# EAGLE schematic ZXUno_Companion_2 (EAGLE 7.6.0)

## Sheet 1 of 2
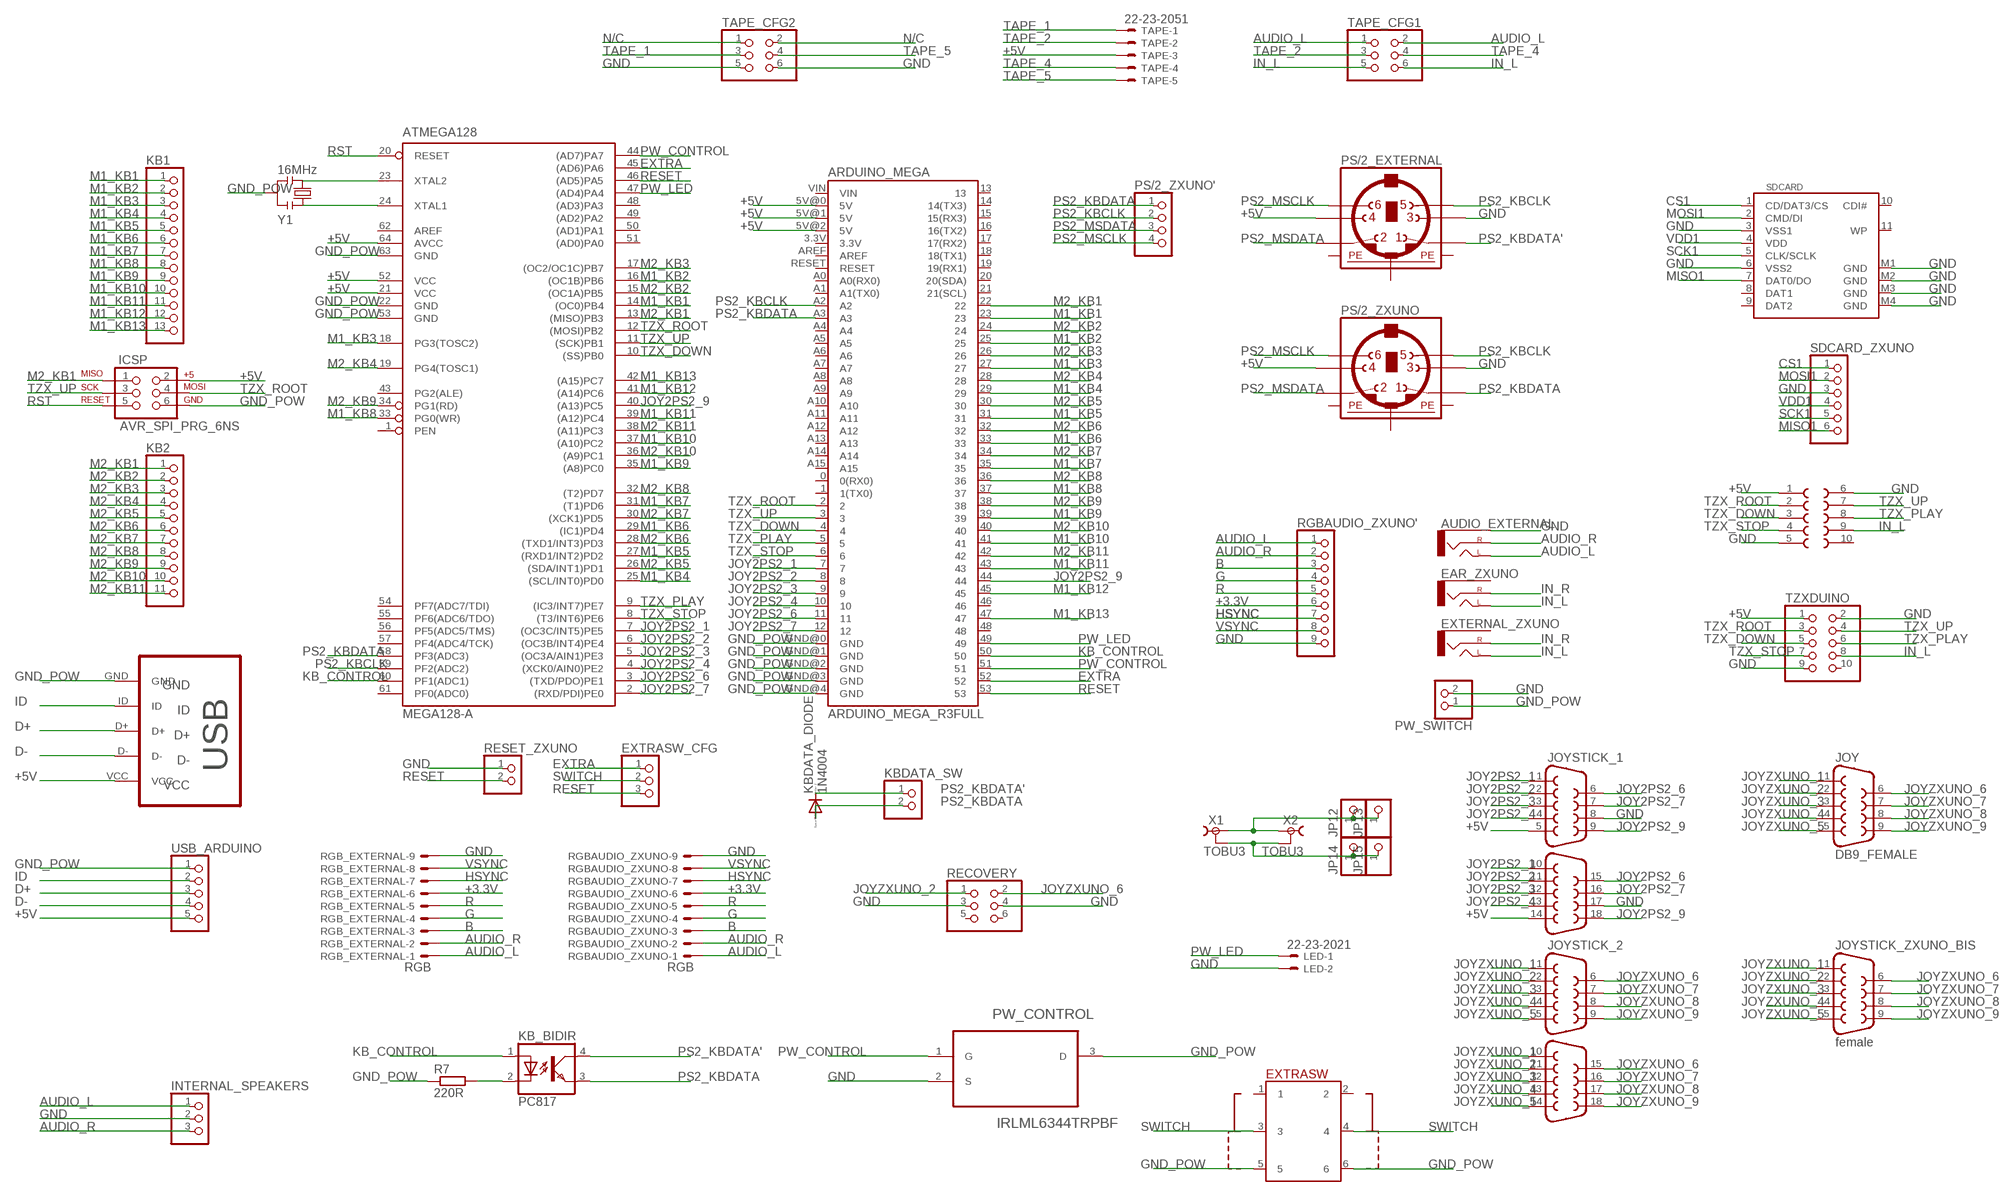
[diagram p0: schematic, sheet 1]

### Parts
ARDUINO_MEGA  ARDUINO_MEGA_R3FULL  [ARDUINO_MEGA]
ATMEGA128  MEGA128-A  [TQFP64]
AUDIO_EXTERNAL  AUDIO-JACKPTH  [AUDIO-JACK]
EAR_ZXUNO  AUDIO-JACKPTH  [AUDIO-JACK]
EXTERNAL_ZXUNO  AUDIO-JACKPTH  [AUDIO-JACK]
EXTRASW  PS-22F03  [PS-22F03]
EXTRASW_CFG  PINHD-1X3  [1X03]
ICSP  AVR_SPI_PRG_6NS  [2X3-NS]
INTERNAL_SPEAKERS  PINHD-1X3  [1X03]
JOY  DB9_FEMALE  [DB9]
JOYSTICK_1  DB9MALE  [DB9_MALE]
JOYSTICK_2  DB9MALE  [DB9_MALE]
JOYSTICK_ZXUNO_BIS  female  F09D  [F09D]
JP12  PINHD-1X1  [1X01]
JP13  PINHD-1X1  [1X01]
JP14  PINHD-1X1  [1X01]
JP15  PINHD-1X1  [1X01]
KB1  PINHD-1X13  [1X13]
KB2  PINHD-1X11  [1X11]
KB_BIDIR  PC817  [DIL04]
KBDATA_DIODE  1N4004  [DO41-10]
KBDATA_SW  PINHD-1X2  [1X02]
LED  22-23-2021  [22-23-2021]
PS/2_EXTERNAL  MINI_DIN_6  [M_DIN6]
PS/2_ZXUNO  MINI_DIN_6  [M_DIN6]
PS/2_ZXUNO'  PINHD-1X4  [1X04]
PW_CONTROL  IRLML6344TRPBF  [SOT95P240X112-3N]
PW_SWITCH  PINHD-1X2  [1X02]
R7  220R  R-EU_0204/7  [0204/7]
RECOVERY  PINHD-2X3  [2X03]
RESET_ZXUNO  PINHD-1X2  [1X02]
RGB_EXTERNAL  RGB  53048-09  [53048-09]
RGBAUDIO_ZXUNO  RGB  53048-09  [53048-09]
RGBAUDIO_ZXUNO'  PINHD-1X9  [1X09]
SDCARD  SDCARD  [SDCMF-10915W010]
SDCARD_ZXUNO  PINHD-1X6  [1X06]
TAPE  22-23-2051  [22-23-2051]
TAPE_CFG1  PINHD-2X3  [2X03]
TAPE_CFG2  PINHD-2X3  [2X03]
TZXDUINO  PINHD-2X5  [2X05]
U$1  MICRO-USB-B  [MICRO_USB_4_LEGS]
USB_ARDUINO  PINHD-1X5  [1X05]
X1  TOBU3  [TOBU3]
X2  TOBU3  [TOBU3]
X5  F09D  [F09D]
Y1  16MHz  0011_CSTCE16M0V53-R0  [RESONATOR]

### Nets
+3.3V: RGB_EXTERNAL.6 RGBAUDIO_ZXUNO'.6 RGBAUDIO_ZXUNO.6 ; also sheet 2
+5V: ARDUINO_MEGA.5V@1(5V) ARDUINO_MEGA.5V@2(5V) ATMEGA128.21(VCC) ATMEGA128.52(VCC) ATMEGA128.64(AVCC) ICSP.2 JOYSTICK_1.5 JOYSTICK_1.14 PS/2_EXTERNAL.4 PS/2_ZXUNO.4 TAPE.3 TZXDUINO.1 U$1.VCC USB_ARDUINO.5 X5.1 ; also sheet 2
AUDIO_L: AUDIO_EXTERNAL.TIP(LEFT) INTERNAL_SPEAKERS.1 RGB_EXTERNAL.1 RGBAUDIO_ZXUNO'.1 RGBAUDIO_ZXUNO.1 TAPE_CFG1.1 TAPE_CFG1.2 ; also sheet 2
AUDIO_R: AUDIO_EXTERNAL.RING(RIGHT) INTERNAL_SPEAKERS.3 RGB_EXTERNAL.2 RGBAUDIO_ZXUNO'.2 RGBAUDIO_ZXUNO.2 ; also sheet 2
B: RGB_EXTERNAL.3 RGBAUDIO_ZXUNO'.3 RGBAUDIO_ZXUNO.3 ; also sheet 2
CS1: SDCARD.1(CD/DAT3/CS) SDCARD_ZXUNO.1
D+: U$1.D+ USB_ARDUINO.3
D-: U$1.D- USB_ARDUINO.4
EXTRA: ARDUINO_MEGA.52 ATMEGA128.45((AD6)PA6) EXTRASW_CFG.1
G: RGB_EXTERNAL.4 RGBAUDIO_ZXUNO'.4 RGBAUDIO_ZXUNO.4 ; also sheet 2
GND: AUDIO_EXTERNAL.SLEEVE INTERNAL_SPEAKERS.2 JOYSTICK_1.8 JOYSTICK_1.17 LED.2 PS/2_EXTERNAL.3 PS/2_ZXUNO.3 PW_CONTROL.2(S) PW_SWITCH.2 RECOVERY.3 RECOVERY.4 RESET_ZXUNO.1 RGB_EXTERNAL.9 RGBAUDIO_ZXUNO'.9 RGBAUDIO_ZXUNO.9 SDCARD.3(VSS1) SDCARD.6(VSS2) SDCARD.M1(GND) SDCARD.M2(GND) SDCARD.M3(GND) SDCARD.M4(GND) SDCARD_ZXUNO.3 TAPE_CFG2.5 TAPE_CFG2.6 TZXDUINO.2 TZXDUINO.9 X5.5 X5.6 ; also sheet 2
GND_POW: ARDUINO_MEGA.GND@0(GND) ARDUINO_MEGA.GND@1(GND) ARDUINO_MEGA.GND@4(GND) ATMEGA128.22(GND) ATMEGA128.53(GND) ATMEGA128.63(GND) EXTRASW.5 EXTRASW.6 ICSP.6 PW_CONTROL.3(D) PW_SWITCH.1 R7.1 U$1.GND USB_ARDUINO.1 Y1.2
HSYNC: RGB_EXTERNAL.7 RGBAUDIO_ZXUNO'.7 RGBAUDIO_ZXUNO.7 ; also sheet 2
ID: U$1.ID USB_ARDUINO.2
IN_L: EAR_ZXUNO.TIP(LEFT) EXTERNAL_ZXUNO.TIP(LEFT) TAPE_CFG1.5 TAPE_CFG1.6 TZXDUINO.8 X5.9
IN_R: EAR_ZXUNO.RING(RIGHT) EXTERNAL_ZXUNO.RING(RIGHT)
JOY2PS2_1: ARDUINO_MEGA.7 ATMEGA128.7((OC3C/INT5)PE5) JOYSTICK_1.1 JOYSTICK_1.10
JOY2PS2_2: ARDUINO_MEGA.8 ATMEGA128.6((OC3B/INT4)PE4) JOYSTICK_1.2 JOYSTICK_1.11
JOY2PS2_3: ARDUINO_MEGA.9 ATMEGA128.5((OC3A/AIN1)PE3) JOYSTICK_1.3 JOYSTICK_1.12
JOY2PS2_4: ARDUINO_MEGA.10 ATMEGA128.4((XCK0/AIN0)PE2) JOYSTICK_1.4 JOYSTICK_1.13
JOY2PS2_6: ARDUINO_MEGA.11 ATMEGA128.3((TXD/PDO)PE1) JOYSTICK_1.6 JOYSTICK_1.15
JOY2PS2_7: ARDUINO_MEGA.12 ATMEGA128.2((RXD/PDI)PE0) JOYSTICK_1.7 JOYSTICK_1.16
JOY2PS2_9: ARDUINO_MEGA.44 ATMEGA128.40((A13)PC5) JOYSTICK_1.9 JOYSTICK_1.18
JOYZXUNO_1: JOY.1 JOYSTICK_2.1 JOYSTICK_2.10 JOYSTICK_ZXUNO_BIS.1
JOYZXUNO_2: JOY.2 JOYSTICK_2.2 JOYSTICK_2.11 JOYSTICK_ZXUNO_BIS.2 RECOVERY.1
JOYZXUNO_3: JOY.3 JOYSTICK_2.3 JOYSTICK_2.12 JOYSTICK_ZXUNO_BIS.3
JOYZXUNO_4: JOY.4 JOYSTICK_2.4 JOYSTICK_2.13 JOYSTICK_ZXUNO_BIS.4
JOYZXUNO_5: JOY.5 JOYSTICK_2.5 JOYSTICK_2.14 JOYSTICK_ZXUNO_BIS.5
JOYZXUNO_6: JOY.6 JOYSTICK_2.6 JOYSTICK_2.15 JOYSTICK_ZXUNO_BIS.6 RECOVERY.2
JOYZXUNO_7: JOY.7 JOYSTICK_2.7 JOYSTICK_2.16 JOYSTICK_ZXUNO_BIS.7
JOYZXUNO_8: JOY.8 JOYSTICK_2.8 JOYSTICK_2.17 JOYSTICK_ZXUNO_BIS.8
JOYZXUNO_9: JOY.9 JOYSTICK_2.9 JOYSTICK_2.18 JOYSTICK_ZXUNO_BIS.9
KB_CONTROL: ARDUINO_MEGA.50 ATMEGA128.60(PF1(ADC1)) KB_BIDIR.1(A)
M1_KB1: ARDUINO_MEGA.23 ATMEGA128.14((OC0)PB4) KB1.1
M1_KB2: ARDUINO_MEGA.25 ATMEGA128.16((OC1B)PB6) KB1.2
M1_KB3: ARDUINO_MEGA.27 ATMEGA128.18(PG3(TOSC2)) KB1.3
M1_KB4: ARDUINO_MEGA.29 ATMEGA128.25((SCL/INT0)PD0) KB1.4
M1_KB5: ARDUINO_MEGA.31 ATMEGA128.27((RXD1/INT2)PD2) KB1.5
M1_KB6: ARDUINO_MEGA.33 ATMEGA128.29((IC1)PD4) KB1.6
M1_KB7: ARDUINO_MEGA.35 ATMEGA128.31((T1)PD6) KB1.7
M1_KB8: ARDUINO_MEGA.37 ATMEGA128.33(PG0(WR)) KB1.8
M1_KB9: ARDUINO_MEGA.39 ATMEGA128.35((A8)PC0) KB1.9
M1_KB10: ARDUINO_MEGA.41 ATMEGA128.37((A10)PC2) KB1.10
M1_KB11: ARDUINO_MEGA.43 ATMEGA128.39((A12)PC4) KB1.11
M1_KB12: ARDUINO_MEGA.45 ATMEGA128.41((A14)PC6) KB1.12
M1_KB13: ARDUINO_MEGA.47 ATMEGA128.42((A15)PC7) KB1.13
M2_KB1: ARDUINO_MEGA.22 ATMEGA128.13((MISO)PB3) ICSP.1 KB2.1
M2_KB2: ARDUINO_MEGA.24 ATMEGA128.15((OC1A)PB5) KB2.2
M2_KB3: ARDUINO_MEGA.26 ATMEGA128.17((OC2/OC1C)PB7) KB2.3
M2_KB4: ARDUINO_MEGA.28 ATMEGA128.19(PG4(TOSC1)) KB2.4
M2_KB5: ARDUINO_MEGA.30 ATMEGA128.26((SDA/INT1)PD1) KB2.5
M2_KB6: ARDUINO_MEGA.32 ATMEGA128.28((TXD1/INT3)PD3) KB2.6
M2_KB7: ARDUINO_MEGA.34 ATMEGA128.30((XCK1)PD5) KB2.7
M2_KB8: ARDUINO_MEGA.36 ATMEGA128.32((T2)PD7) KB2.8
M2_KB9: ARDUINO_MEGA.38 ATMEGA128.34(PG1(RD)) KB2.9
M2_KB10: ARDUINO_MEGA.40 ATMEGA128.36((A9)PC1) KB2.10
M2_KB11: ARDUINO_MEGA.42 ATMEGA128.38((A11)PC3) KB2.11
MISO1: SDCARD.7(DAT0/DO) SDCARD_ZXUNO.6
MOSI1: SDCARD.2(CMD/DI) SDCARD_ZXUNO.2
N$2: JP12.1 JP13.1 X1.1 X2.1
N$3: JP14.1 JP15.1 X1.2 X1.2@1 X1.2@2 X2.2 X2.2@1 X2.2@2
N$5: KB_BIDIR.2(C) R7.2
N$6: ATMEGA128.23(XTAL2) Y1.3
N$7: ATMEGA128.24(XTAL1) Y1.1
N/C: TAPE_CFG2.1 TAPE_CFG2.2
PS2_KBCLK: ARDUINO_MEGA.A2 ATMEGA128.59(PF2(ADC2)) PS/2_EXTERNAL.5 PS/2_ZXUNO'.2 PS/2_ZXUNO.5
PS2_KBDATA: ARDUINO_MEGA.A3 ATMEGA128.58(PF3(ADC3)) KB_BIDIR.3(EMIT) KBDATA_DIODE.A KBDATA_SW.2 PS/2_ZXUNO'.1 PS/2_ZXUNO.1
PS2_KBDATA': KB_BIDIR.4(COL) KBDATA_DIODE.C KBDATA_SW.1 PS/2_EXTERNAL.1
PS2_MSCLK: PS/2_EXTERNAL.6 PS/2_ZXUNO'.4 PS/2_ZXUNO.6
PS2_MSDATA: PS/2_EXTERNAL.2 PS/2_ZXUNO'.3 PS/2_ZXUNO.2
PW_CONTROL: ARDUINO_MEGA.51 ATMEGA128.44((AD7)PA7) PW_CONTROL.1(G)
PW_LED: ARDUINO_MEGA.49 ATMEGA128.47((AD4)PA4) LED.1
R: RGB_EXTERNAL.5 RGBAUDIO_ZXUNO'.5 RGBAUDIO_ZXUNO.5 ; also sheet 2
RESET: ARDUINO_MEGA.53 ATMEGA128.46((AD5)PA5) EXTRASW_CFG.3 RESET_ZXUNO.2
RST: ATMEGA128.20(RESET) ICSP.5
SCK1: SDCARD.5(CLK/SCLK) SDCARD_ZXUNO.5
SWITCH: EXTRASW.3 EXTRASW.4 EXTRASW_CFG.2
TAPE_1: TAPE.1 TAPE_CFG2.3
TAPE_2: TAPE.2 TAPE_CFG1.3
TAPE_4: TAPE.4 TAPE_CFG1.4
TAPE_5: TAPE.5 TAPE_CFG2.4
TZX_DOWN: ARDUINO_MEGA.4 ATMEGA128.10((SS)PB0) TZXDUINO.5 X5.3
TZX_PLAY: ARDUINO_MEGA.5 ATMEGA128.9((IC3/INT7)PE7) TZXDUINO.6 X5.8
TZX_ROOT: ARDUINO_MEGA.2 ATMEGA128.12((MOSI)PB2) ICSP.4 TZXDUINO.3 X5.2
TZX_STOP: ARDUINO_MEGA.6 ATMEGA128.8((T3/INT6)PE6) TZXDUINO.7 X5.4
TZX_UP: ARDUINO_MEGA.3 ATMEGA128.11((SCK)PB1) ICSP.3 TZXDUINO.4 X5.7
VDD1: SDCARD.4(VDD) SDCARD_ZXUNO.4
VSYNC: RGB_EXTERNAL.8 RGBAUDIO_ZXUNO'.8 RGBAUDIO_ZXUNO.8 ; also sheet 2
Unconnected: ARDUINO_MEGA.0(0(RX0)) ARDUINO_MEGA.1(1(TX0)) ARDUINO_MEGA.3.3V ARDUINO_MEGA.5V@0(5V) ARDUINO_MEGA.13 ARDUINO_MEGA.14(14(TX3)) ARDUINO_MEGA.15(15(RX3)) ARDUINO_MEGA.16(16(TX2)) ARDUINO_MEGA.17(17(RX2)) ARDUINO_MEGA.18(18(TX1)) ARDUINO_MEGA.19(19(RX1)) ARDUINO_MEGA.20(20(SDA)) ARDUINO_MEGA.21(21(SCL)) ARDUINO_MEGA.46 ARDUINO_MEGA.48 ARDUINO_MEGA.A0(A0(RX0)) ARDUINO_MEGA.A1(A1(TX0)) ARDUINO_MEGA.A4 ARDUINO_MEGA.A5 ARDUINO_MEGA.A6 ARDUINO_MEGA.A7 ARDUINO_MEGA.A8 ARDUINO_MEGA.A9 ARDUINO_MEGA.A10 ARDUINO_MEGA.A11 ARDUINO_MEGA.A12 ARDUINO_MEGA.A13 ARDUINO_MEGA.A14 ARDUINO_MEGA.A15 ARDUINO_MEGA.AREF ARDUINO_MEGA.GND@2(GND) ARDUINO_MEGA.GND@3(GND) ARDUINO_MEGA.RESET ARDUINO_MEGA.VIN ATMEGA128.1(PEN) ATMEGA128.43(PG2(ALE)) ATMEGA128.48((AD3)PA3) ATMEGA128.49((AD2)PA2) ATMEGA128.50((AD1)PA1) ATMEGA128.51((AD0)PA0) ATMEGA128.54(PF7(ADC7/TDI)) ATMEGA128.55(PF6(ADC6/TDO)) ATMEGA128.56(PF5(ADC5/TMS)) ATMEGA128.57(PF4(ADC4/TCK)) ATMEGA128.61(PF0(ADC0)) ATMEGA128.62(AREF) EAR_ZXUNO.SLEEVE EXTERNAL_ZXUNO.SLEEVE EXTRASW.1 EXTRASW.2 RECOVERY.5 RECOVERY.6 SDCARD.8(DAT1) SDCARD.9(DAT2) SDCARD.10(CDI#) SDCARD.11(WP) TZXDUINO.10 X5.10

## Sheet 2 of 2
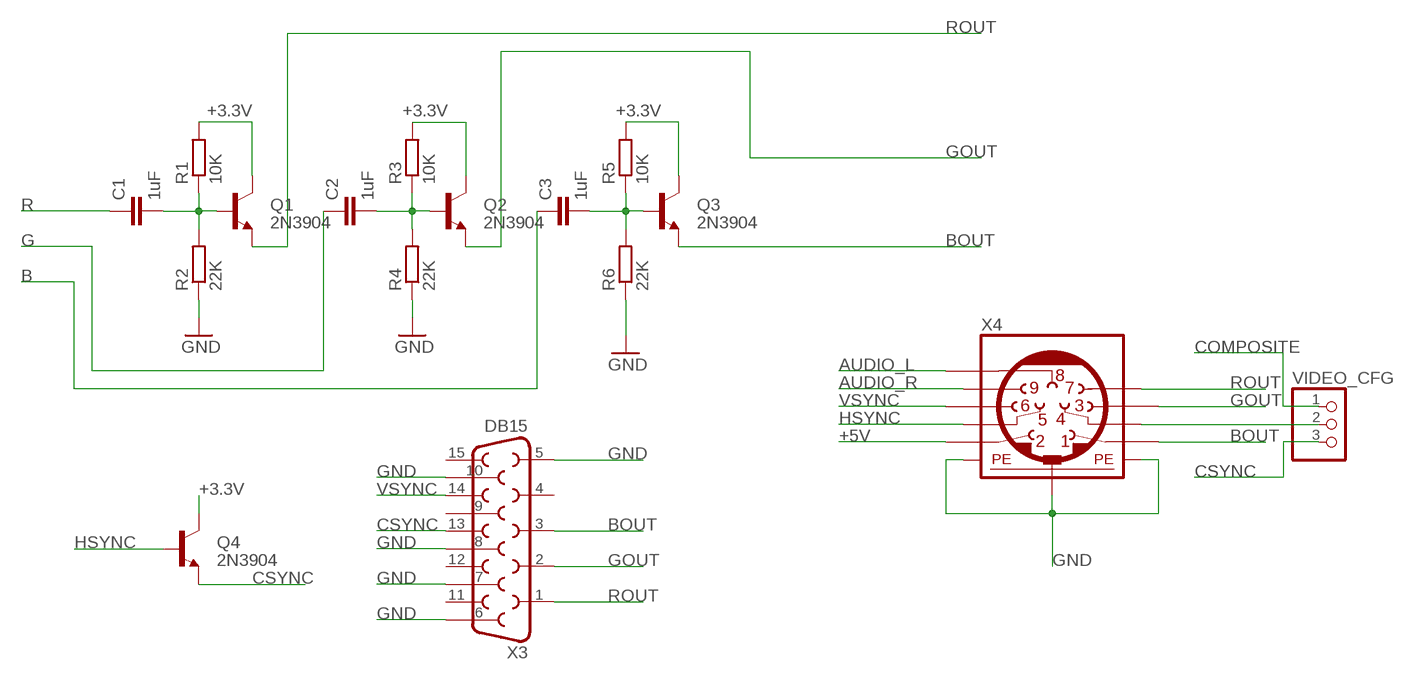
[diagram p1: schematic, sheet 2]

### Parts
C1  1uF  C-EU050-035X075  [C050-035X075]
C2  1uF  C-EU050-035X075  [C050-035X075]
C3  1uF  C-EU050-035X075  [C050-035X075]
Q1  2N3904  TRANSISTOR_NPN2N3904  [TO-92]
Q2  2N3904  TRANSISTOR_NPN2N3904  [TO-92]
Q3  2N3904  TRANSISTOR_NPN2N3904  [TO-92]
Q4  2N3904  TRANSISTOR_NPN2N3904  [TO-92]
R1  10K  R-EU_0204/7  [0204/7]
R2  22K  R-EU_0204/7  [0204/7]
R3  10K  R-EU_0204/7  [0204/7]
R4  22K  R-EU_0204/7  [0204/7]
R5  10K  R-EU_0204/7  [0204/7]
R6  22K  R-EU_0204/7  [0204/7]
VIDEO_CFG  PINHD-1X3  [1X03]
X3  DB15  [DB15]
X4  MINI_DIN_9  [M_DIN9]

### Nets
+3.3V: Q1.3(C) Q2.3(C) Q3.3(C) Q4.3(C) R1.2 R3.2 R5.2 ; also sheet 1
+5V: X4.2 ; also sheet 1
AUDIO_L: X4.8 ; also sheet 1
AUDIO_R: X4.9 ; also sheet 1
B: C3.1 ; also sheet 1
BOUT: Q3.1(E) X3.3 X4.1
COMPOSITE: VIDEO_CFG.1
CSYNC: Q4.1(E) VIDEO_CFG.3 X3.13
G: C2.1 ; also sheet 1
GND: R2.1 R4.1 R6.1 X3.5 X3.6 X3.7 X3.8 X3.10 X4.SH1(PE1) X4.SH2(PE2) X4.SH3(PE3) ; also sheet 1
GOUT: Q2.1(E) X3.2 X4.3
HSYNC: Q4.2(B) X4.5 ; also sheet 1
N$1: VIDEO_CFG.2 X4.4
N$4: C1.2 Q1.2(B) R1.1 R2.2
N$8: C3.2 Q3.2(B) R5.1 R6.2
N$11: C2.2 Q2.2(B) R3.1 R4.2
R: C1.1 ; also sheet 1
ROUT: Q1.1(E) X3.1 X4.7
VSYNC: X3.14 X4.6 ; also sheet 1
Unconnected: X3.4 X3.9 X3.11 X3.12 X3.15

## Power pins joined to a net without a drawn wire
PE1: PS/2_EXTERNAL.SH1(PE1) PS/2_ZXUNO.SH1(PE1)
PE2: PS/2_EXTERNAL.SH2(PE2) PS/2_ZXUNO.SH2(PE2)
PE3: PS/2_EXTERNAL.SH3(PE3) PS/2_ZXUNO.SH3(PE3)

## Library data of the parts
ARDUINO_MEGA = SparkFun-Boards2:ARDUINO_MEGA_R3: Arduino Mega R3 ATmega2560 R3 compatible footprint. SparkFun Products: Arduino Mega 2560 R3 <https://www.sparkfun.com/products/11061>
ATMEGA128 = atmel:MEGA128: MICROCONTROLLER 128 Kbytes FLASH 4 Kbytes SRAM 4 Kbytes EEPROM DUAL USART 8-channel 10 bit ADC Source: avr.lbr; MPN: ATMEGA128-16AU; OC_FARNELL: 9171118; OC_NEWARK: 95K7364
AUDIO_EXTERNAL EAR_ZXUNO EXTERNAL_ZXUNO = SparkFun-Connectors:AUDIO-JACK: 3.5mm Audio Jack Simple 3.5mm common PCB mount audio jack. Variant PTH is our storefront SKU PRT-08032
C1-C3 = resistor:C-EU: CAPACITOR, European symbol
EXTRASW = A03 PS-22F03:PS-22F03
EXTRASW_CFG INTERNAL_SPEAKERS VIDEO_CFG = pinhead:PINHD-1X3: PIN HEADER
ICSP = SparkFun-Connectors:AVR_SPI_PRG_6: AVR ISP 6 Pin This is the reduced ISP connector for AVR programming. Common on Arduino. This footprint will take up less PCB space and can be used with a 10-pin to 6-pin adapter such as SKU: BOB-08508 **Special note about "TEST_POINT" package. The stop mask is on the top side, so if you want your programming test points to be on the bottom of your board, make sure to place this package on the bottom side of the board. This also ensure that the orientation to program from the bottom side will be correct.
JOY = SparkFun-Connectors:DB9_FEMALE
JOYSTICK_1 JOYSTICK_2 = SparkFun-Connectors:DB9: DB9 Connector Standard DB9 (D-Sub 9) serial connector. Can be used for CAN bus as well as RS485 and RS232. Footprint production proven. Spark Fun Electronics SKU : PRT-00429; PROD_ID: CONN-09904
JOYSTICK_ZXUNO_BIS = con-subd:F09: SUB-D; OC_FARNELL: unknown; OC_NEWARK: unknown
JP12-JP15 = pinhead:PINHD-1X1: PIN HEADER
KB1 = pinhead:PINHD-1X13: PIN HEADER
KB2 = pinhead:PINHD-1X11: PIN HEADER
KB_BIDIR = optocoupler:PC817: SHARP OPTO COUPLER; MPN: PC817X4J000F; OC_FARNELL: 9707727; OC_NEWARK: 97K7059
KBDATA_DIODE = diode:1N4004: DIODE general purpose rectifier, 1 A
KBDATA_SW PW_SWITCH RESET_ZXUNO = pinhead:PINHD-1X2: PIN HEADER
LED = con-molex:22-23-2021: .100" (2.54mm) Center Header - 2 Pin; MF: MOLEX; MPN: 22-23-2021; OC_FARNELL: 1462926; OC_NEWARK: 25C3832
PS/2_EXTERNAL PS/2_ZXUNO = mini_din:MINI_DIN_6
PS/2_ZXUNO' = pinhead:PINHD-1X4: PIN HEADER
PW_CONTROL = International_Rectifier_By_element14_Batch_1:IRLML6344TRPBF: Power MOSFET; MPN: IRLML6344TRPBF; OC_FARNELL: 1857299; OC_NEWARK: 25T5501; PACKAGE: SOT-23-3; SUPPLIER: INTERNATIONAL RECTIFIER
Q1-Q4 = SparkFun-DiscreteSemi:TRANSISTOR_NPN: Generic NPN BJT MMBT2222A - TRANS-08049 (SOT-23, 1A 40V) MPSA42 - TRANS-09116 (SOT-23, 500mA 300V) MMBT5088LT1G - TRANS-11160 (SOT-23, 50 mA 30V) BC547 - COM-08928 <http://www.sparkfun.com/products/8928> (TO-92 45V 100mA) (1.Collector 2.Base 3.Emitter) 2N3904 - COM-00521 <http://www.sparkfun.com/products/521> (TO-92 40V 200mA) (1.Emitter 2.Base 3.Collector) P2N2222A - COM-12852 <http://www.sparkfun.com/products/12852> (TO-92 40V 600mA) (1.Collector 2.Base 3.Emitter); PROD_ID: TRANS-08447
R1-R7 = resistor:R-EU_: RESISTOR, European symbol
RECOVERY TAPE_CFG1 TAPE_CFG2 = pinhead:PINHD-2X3: PIN HEADER
RGB_EXTERNAL RGBAUDIO_ZXUNO = con-molex:53?-09: CONNECTOR wire to board 1.25 mm (.049 inch) pitch header; MPN: 53048-0910; OC_FARNELL: 1012239; OC_NEWARK: 98K9837
RGBAUDIO_ZXUNO' = pinhead:PINHD-1X9: PIN HEADER
SDCARD = zxuno_rev_mcleod:SDCARD: SD card connector KINGFONT SDCMF-10915W010
SDCARD_ZXUNO = pinhead:PINHD-1X6: PIN HEADER
TAPE = con-molex:22-23-2051: .100" (2.54mm) Center Header - 5 Pin; MF: MOLEX; MPN: 22-23-2051; OC_FARNELL: 1462952; OC_NEWARK: 38C9178
TZXDUINO = pinhead:PINHD-2X5: PIN HEADER
U$1 = micro usb B - 4LEGS:MICRO-USB-B
USB_ARDUINO = pinhead:PINHD-1X5: PIN HEADER
X1 X2 = con-hirschmann:TOBU3: Female Cinch CONNECTOR ( RCA Jack ); MF: FARNELL; MPN: TOBU 3; OC_FARNELL: 592791; OC_NEWARK: 06WX5914
X3 = SparkFun-Connectors:DB15: DB15 / VGA right angle through-hole female connector.
X4 = mini_din:MINI_DIN_9
X5 = con-subd-spark2k06:F09: SUB-D; OC_FARNELL: unknown; OC_NEWARK: unknown
Y1 = Cristalli:0011_CSTCE16M0V53-R0: 16Mhz - SMD; MONTHLY_USAGE: _____; PART_NUMBER: CSTCE16M0V53-R0; PRICE: _____; SUPPLIER: _____; TYPE: Cristalli; VALUE: CSTCE16M0V53-R0